# Altium schematic sheet BoosterSystem.SchDoc
size A
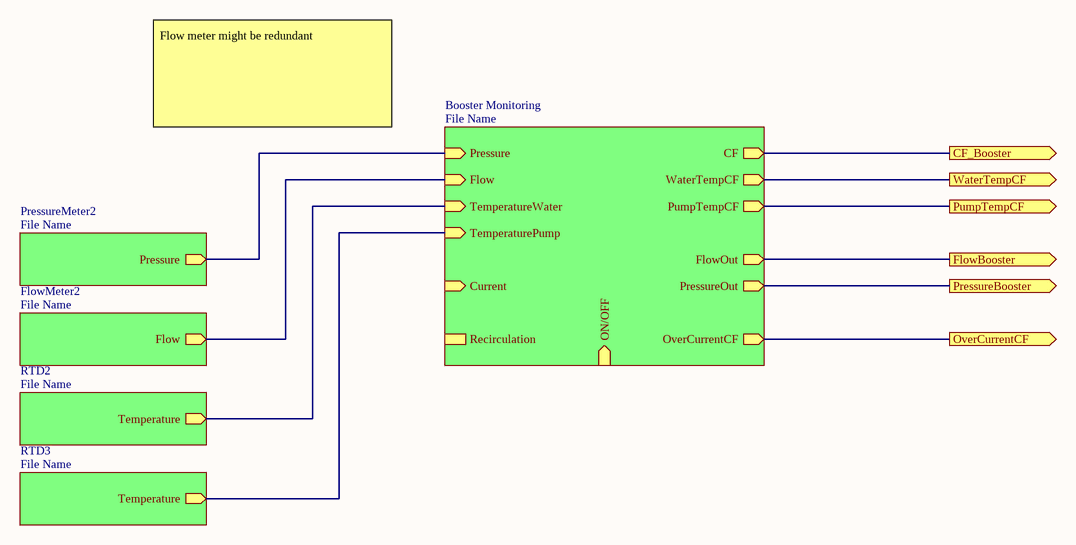
[diagram p0: BoosterSystem.SchDoc]

## Sub-sheets
Booster Monitoring = File Name: Pressure (in), Flow (in), TemperatureWater (in), Current (in), Recirculation, ON/OFF (in), CF (out), FlowOut (out), PressureOut (out), TemperaturePump (in), WaterTempCF (out), PumpTempCF (out), OverCurrentCF (out)
FlowMeter2 = File Name: Flow (out)
PressureMeter2 = File Name: Pressure (out)
RTD2 = File Name: Temperature (out)
RTD3 = File Name: Temperature (out)

## Ports
CF_Booster (out), FlowBooster (out), OverCurrentCF (out), PressureBooster (out), PumpTempCF (out), WaterTempCF (out)

## Nets
CF_Booster: port CF_Booster, sheet Booster Monitoring/CF
FlowBooster: port FlowBooster, sheet Booster Monitoring/FlowOut
OverCurrentCF: port OverCurrentCF, sheet Booster Monitoring/OverCurrentCF
PressureBooster: port PressureBooster, sheet Booster Monitoring/PressureOut
PumpTempCF: port PumpTempCF, sheet Booster Monitoring/PumpTempCF
WaterTempCF: port WaterTempCF, sheet Booster Monitoring/WaterTempCF
(unnamed): sheet Booster Monitoring/Pressure, sheet PressureMeter2/Pressure
(unnamed): sheet Booster Monitoring/Flow, sheet FlowMeter2/Flow
(unnamed): sheet Booster Monitoring/TemperatureWater, sheet RTD2/Temperature
(unnamed): sheet Booster Monitoring/TemperaturePump, sheet RTD3/Temperature

## Notes on the sheet
- Flow meter might be redundant